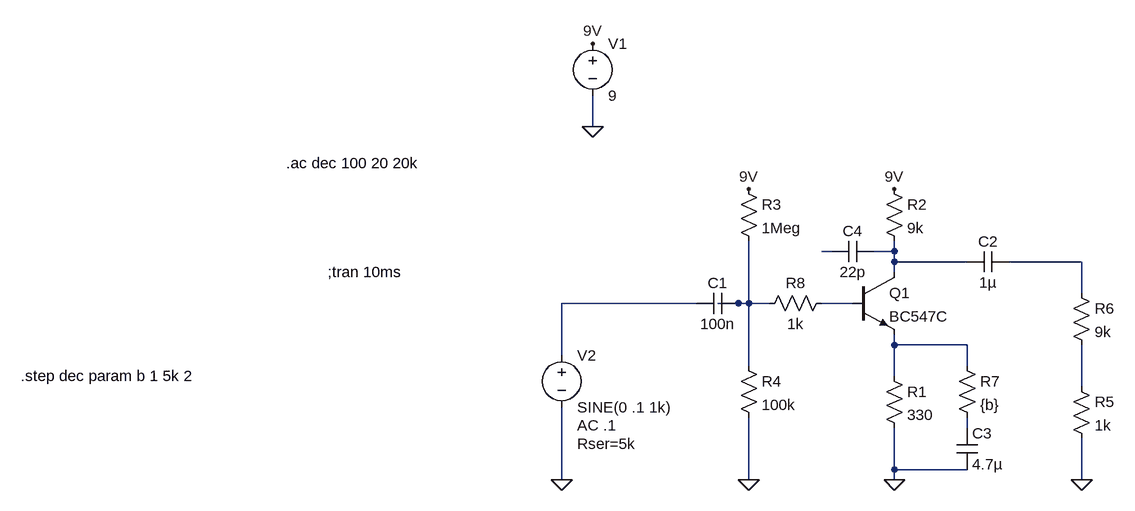
[diagram p0: schematic TrebleBoost.asc]
TrebleBoost.asc, the LTspice schematic file:
Version 4
SHEET 1 880 680
WIRE -256 -96 -256 -144
WIRE 112 96 96 96
WIRE 208 96 208 80
WIRE 208 96 176 96
WIRE 208 112 208 96
WIRE 320 112 208 112
WIRE 496 112 384 112
WIRE 208 128 208 112
WIRE 496 160 496 112
WIRE -96 176 -304 176
WIRE -32 176 -64 176
WIRE -16 176 -16 80
WIRE -16 176 -32 176
WIRE 16 176 -16 176
WIRE 144 176 96 176
WIRE 208 240 208 224
WIRE 320 240 208 240
WIRE -304 256 -304 176
WIRE -16 272 -16 176
WIRE 320 272 320 240
WIRE 208 288 208 240
WIRE 496 304 496 240
WIRE 320 368 320 352
WIRE 208 432 208 368
WIRE 320 432 208 432
WIRE -304 448 -304 336
WIRE -16 448 -16 352
WIRE 208 448 208 432
WIRE 496 448 496 384
FLAG -256 -96 0
FLAG -304 448 0
FLAG -16 448 0
FLAG 208 448 0
FLAG 496 448 0
FLAG -256 -224 9V
FLAG -16 0 9V
FLAG 208 0 9V
DATAFLAG 208 240 ""
DATAFLAG 112 176 ""
SYMBOL npn 144 128 R0
SYMATTR InstName Q1
SYMATTR Value BC547C
SYMBOL res 192 272 R0
SYMATTR InstName R1
SYMATTR Value 330
SYMBOL res 192 -16 R0
SYMATTR InstName R2
SYMATTR Value 9k
SYMBOL res -32 -16 R0
SYMATTR InstName R3
SYMATTR Value 1Meg
SYMBOL res -32 256 R0
SYMATTR InstName R4
SYMATTR Value 100k
SYMBOL res 480 288 R0
SYMATTR InstName R5
SYMATTR Value 1k
SYMBOL res 480 144 R0
SYMATTR InstName R6
SYMATTR Value 9k
SYMBOL cap -32 160 R90
WINDOW 0 0 32 VBottom 2
WINDOW 3 32 32 VTop 2
SYMATTR InstName C1
SYMATTR Value 100n
SYMBOL cap 384 96 R90
WINDOW 0 0 32 VBottom 2
WINDOW 3 32 32 VTop 2
SYMATTR InstName C2
SYMATTR Value 1µ
SYMBOL voltage -256 -240 R0
WINDOW 123 0 0 Left 2
WINDOW 39 0 0 Left 2
SYMATTR InstName V1
SYMATTR Value 9
SYMBOL voltage -304 240 R0
WINDOW 123 24 124 Left 2
WINDOW 39 24 152 Left 2
SYMATTR Value2 AC .1
SYMATTR SpiceLine Rser=5k
SYMATTR InstName V2
SYMATTR Value SINE(0 .1 1k)
SYMBOL cap 304 368 R0
SYMATTR InstName C3
SYMATTR Value 4.7µ
SYMBOL cap 176 80 R90
WINDOW 0 0 32 VBottom 2
WINDOW 3 32 32 VTop 2
SYMATTR InstName C4
SYMATTR Value 22p
SYMBOL res 304 256 R0
SYMATTR InstName R7
SYMATTR Value {b}
SYMBOL res 112 160 R90
WINDOW 0 0 56 VBottom 2
WINDOW 3 32 56 VTop 2
SYMATTR InstName R8
SYMATTR Value 1k
TEXT -728 -40 Left 2 !.ac dec 100 20 20k
TEXT -664 128 Left 2 !;tran 10ms
TEXT -1136 288 Left 2 !.step dec param b 1 5k 2

The netlist it stands for:
* TrebleBoost.asc
Q1 N002 N006 N007 0 BC547C
R1 N007 0 330
R2 9V N002 9k
R3 9V N005 1Meg
R4 N005 0 100k
R5 N008 0 1k
R6 N003 N008 9k
C1 N005 N004 100n
C2 N003 N002 1µ
V1 9V 0 9
V2 N004 0 SINE(0 .1 1k) AC .1 Rser=5k
C3 N009 0 4.7µ
C4 N002 N001 22p
R7 N007 N009 {b}
R8 N006 N005 1k
.model NPN NPN
.model PNP PNP
.lib standard.bjt
.ac dec 100 20 20k
;tran 10ms
.step dec param b 1 5k 2
.backanno
.end